# EAGLE board Mayfly_v1p0_revA3_public (EAGLE 9.6.2), part 1 of 2
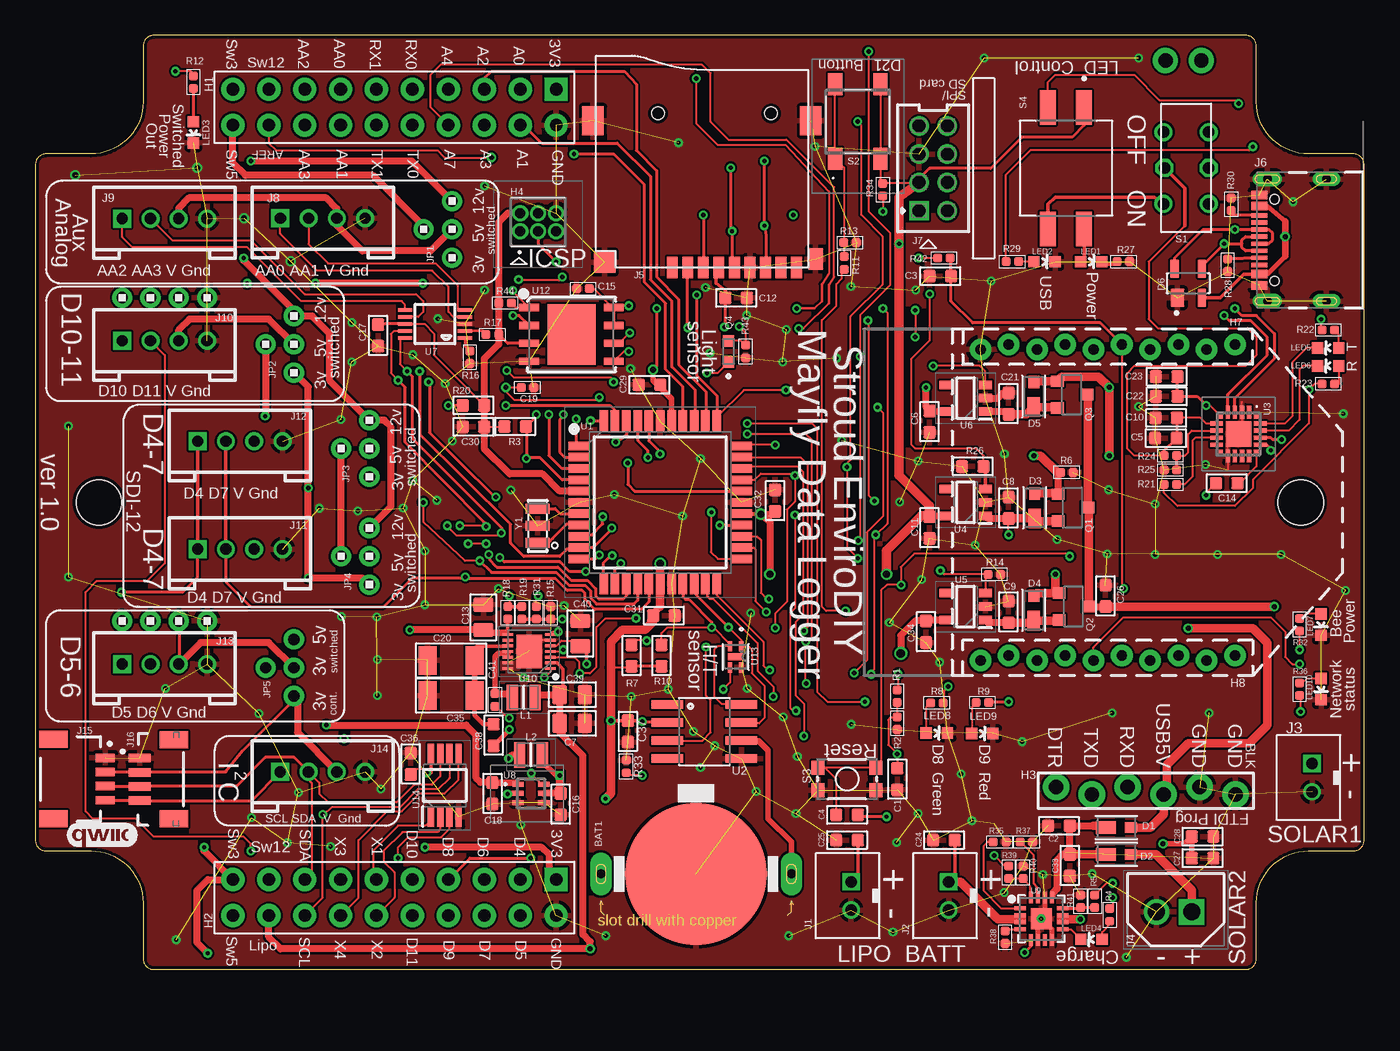
[diagram p1: board, top side]
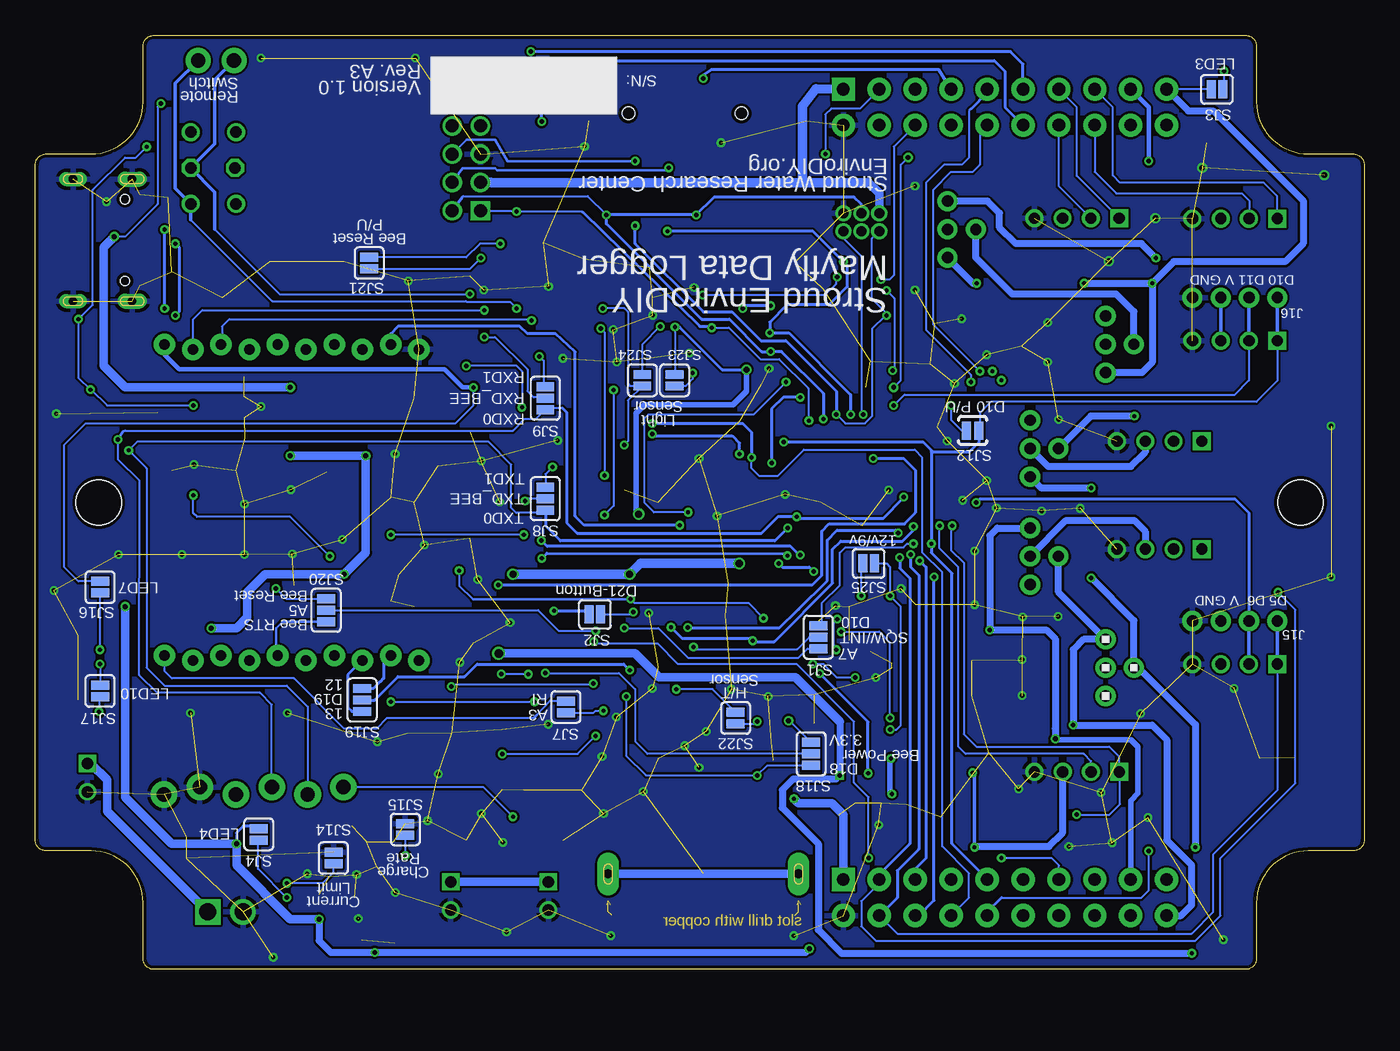
[diagram p2: board, bottom side, seen from below]

Size 93.98 x 66.04 mm. Coordinates in mm from the lower left corner, seen from the top.
Outline: 0,56.9 0,9.14 arc90 0.76,8.38 3.94,8.38 arc-90 7.62,4.7 7.62,0.76 arc90 8.38,0 85.6,0 arc90 86.36,0.76 86.36,4.7 arc-90 90.04,8.38 93.22,8.38 arc90 93.98,9.14 93.98,56.9 arc90 93.22,57.66 90.04,57.66 arc-90 86.36,61.34 86.36,65.28 arc90 85.6,66.04 8.38,66.04 arc90 7.62,65.28 7.62,61.34 arc-90 3.94,57.66 0.76,57.66 arc90 0,56.9
Copper layers (1*2*15*16): Top 0.035mm / dielectric 0.2mm / Route2 0.0175mm / dielectric 1.1mm / Route15 0.0175mm / dielectric 0.2mm / Bottom 0.035mm
Design rules "DEEGOU-DRU": minimum track width 6mil, minimum drill 12mil, track to track 6mil, track to pad 6mil, pad to pad 6mil, via to via 6mil, smd to smd 0mil, copper to edge 10mil, drill to drill 10mil, minimum pad ring 6mil, minimum via ring 6mil, stop-mask expansion 2mil, vias tented up to drill 25mil, thermal gap 10mil
Holes 3.2 mm at 89.5,33.02 4.5,33.02

## Footprints (pad centres in the part's own frame; a part is rotated, then mirrored left to right if it is on the bottom)
BAT2P-13.5-CR1220 = drill 0.635 pad 1.524 long: +1 6.731,0; +2 -6.731,0 | smd 10 x 10: - 0,0
C0603 = smd 0.889 x 0.889: 1 -0.762,0; 2 0.762,0
C0805 = smd 1.397 x 1.016: 1 0,0.889; 2 0,-0.889
C0402 = smd 0.635 x 0.635: 1 -0.445,0; 2 0.445,0
C0603' = smd 0.889 x 0.889: 1 0,0.762; 2 0,-0.762
C1206 = smd 1.27 x 2.032: 1 -1.651,0; 2 1.651,0
DIODE_MSP3V3 = smd 1.397 x 0.889: 1 -0.749,0 | smd 0.864 x 0.762: 2 1.016,0
SOT143 = smd 0.99 x 1.3: 1 -0.76,-1.025 | smd 0.59 x 1.3: 2 0.96,-1.025; 3 0.96,1.025; 4 -0.96,1.025
H2X10-2.54 = drill 0.889 pad 1.651 square: 1 -1.27,11.43 | drill 0.889 pad 1.651: 2 -1.27,8.89; 3 -1.27,6.35; 4 -1.27,3.81; 5 -1.27,1.27; 6 -1.27,-1.27; 7 -1.27,-3.81; 8 -1.27,-6.35; 9 -1.27,-8.89; 10 -1.27,-11.43; 11 1.27,-11.43; 12 1.27,-8.89; 13 1.27,-6.35; 14 1.27,-3.81; 15 1.27,-1.27; 16 1.27,1.27; 17 1.27,3.81; 18 1.27,6.35; 19 1.27,8.89; 20 1.27,11.43
1X06_FEMALE_LOCK.010 = drill 1.016 pad 1.88: 1 0,0.254; 2 2.54,-0.254; 3 5.08,0.254; 4 7.62,-0.254; 5 10.16,0.254; 6 12.7,-0.254
FTSH-103-XX-YYY = drill 0.71 pad 1.15: 1 0,0; 2 0,1.27; 3 1.27,0; 4 1.27,1.27; 5 2.54,0; 6 2.54,1.27
1X4 = drill 0.8 pad 1.422: 1 -3,0; 2 -1,0; 3 1,0; 4 3,0
XBEE-1_LOCK = drill 0.737 pad 1.524: 1 -11.178,20; 2 -10.822,18; 3 -11.178,16; 4 -10.822,14; 5 -11.178,12; 6 -10.822,10; 7 -11.178,8; 8 -10.822,6; 9 -11.178,4; 10 -10.822,2; 11 11.178,2; 12 10.822,4; 13 11.178,6; 14 10.822,8; 15 11.178,10; 16 10.822,12; 17 11.178,14; 18 10.822,16; 19 11.178,18; 20 10.822,20
PTH-JUMPER-2-NO_NO_SILK = drill 1.016 pad 1.778: 1 -1.27,0; 2 1.27,0
JST_EPH_B2B-PH-K-S = drill 0.813 square: 1 2,0 | drill 0.813: 2 0,0
SHDR2W70P0X250_1X2_670X500X765 = drill 1.2 pad 1.8 square: 1 0,0 | drill 1.2 pad 1.8: 2 2.5,0
9P-SMD-W-RING = smd 1.524 x 0.762: 1 -7.493,2.114; 2 -7.493,1.014; 3 -7.493,-0.086; 4 -7.493,-1.186; 5 -7.493,-2.286; 6 -7.493,-3.386; 7 -7.493,-4.486; 8 -7.493,-5.586; 9 -7.493,-6.686 | smd 1.524 x 1.016: G1 -6.893,-8.032 | smd 2.032 x 1.524: G2 2.88,-7.686; G3 2.88,7.714 | smd 1.524 x 1.524: G4 -7.101,6.895 | hole 0.889: 3.407,-4.886; 3.407,3.114
GCT_USB4105_REVA = smd 0.6 x 1.15: A1/B12 -3.2,4.755; A4/B9 -2.4,4.755; B1/A12 3.2,4.755; B4/A9 2.4,4.755 | smd 0.3 x 1.15: A5 -1.25,4.755; A6 -0.25,4.755; A7 0.25,4.755; A8 1.25,4.755; B5 1.75,4.755; B6 0.75,4.755; B7 -0.75,4.755; B8 -1.75,4.755 | drill 0.6 pad 1 long: G1 -4.32,0; G2 4.32,0 | drill 0.6 pad 1.05 long: G3 -4.32,4.18; G4 4.32,4.18 | hole 0.65: 2.89,3.68; -2.89,3.68
79107-08 = drill 0.914 square: 1 -3,1 | drill 0.914: 2 -3,-1; 3 -1,1; 4 -1,-1; 5 1,1; 6 1,-1; 7 3,1; 8 3,-1
HW4-2.0 = drill 0.8 pad 1.27 square: 1 -3,0 | drill 0.8 pad 1.27: 2 -1,0; 3 1,0; 4 3,0
JST04_1MM_RA = smd 0.6 x 1.35: 1 -1.5,0; 2 -0.5,0; 3 0.5,0; 4 1.5,0 | smd 1.2 x 2: NC1 2.8,-3.675; NC2 -2.8,-3.675
JST04_1MM_VERT = smd 0.6 x 1.55: 1 -1.478,0.775; 2 -0.478,0.775; 3 0.522,0.775; 4 1.522,0.775 | smd 1.2 x 2: NC1 -2.778,3.2; NC2 2.822,3.2
1X3 = drill 0.8 pad 1.422: 1 -2,0; 2 0,0; 3 2,0; 4 0,-2
1285ASH1R0MP2 = smd 0.8 x 1.8: 1 -0.8,0; 2 0.8,0
LED-0603 = smd 0.8 x 0.8: A 0,-0.75; C 0,0.75
SOT23-S-PADS = smd 0.8 x 0.9: 1 -0.95,-1; 2 0.95,-1; 3 0,1.1
XDCR_ALS-PT19-315C/L177/TR8 = smd 0.8 x 0.8: 1 -0.75,0; 2 0.75,0
R0402 = smd 0.635 x 0.635: 1 -0.445,0; 2 0.445,0
R0603 = smd 0.889 x 0.889: 1 -0.762,0; 2 0.762,0
6P-2CH-2.54-9.1X3.5X3.2+2H = drill 0.813 pad 1.27: CH1A -2.54,-1.6; CH1B 2.54,-1.6; CH2A -2.54,1.6; CH2B 2.54,1.6 | drill 0.813 pad 1.27 octagon: COM1 0,-1.6; COM2 0,1.524
PTS647SK38SMTR2LFS = smd 1.55 x 1: 1 -2.625,1.6; 2 2.625,1.6; 3 -2.625,-1.6; 4 2.625,-1.6
TACTILE_SWITCH_SMD_4.6X2.8MM = smd 0.9 x 1: 1 -2.05,-0.8; 2 2.05,-0.8; 3 2.05,0.8; 4 -2.05,0.8
SW_219-2MSTR = smd 2.44 x 1.13: 1A -4.3,1.27; 1B 4.3,1.27; 2A -4.3,-1.27; 2B 4.3,-1.27
SMT-JUMPER_3_1-NC_PASTE_SILK = smd 0.635 x 1.27: 1 -0.813,0; 2 0,0; 3 0.813,0
SMT-JUMPER_2_NC_PASTE_SILK = smd 0.635 x 1.27: 1 -0.406,0; 2 0.406,0
SMT-JUMPER_2_NO_SILK = smd 0.635 x 1.27: 1 -0.406,0; 2 0.406,0
SJ_2S-NO = smd 0.635 x 1.27: 1 -0.45,0; 2 0.45,0
QFP80P1200X1200X120-44N = smd 1.5 x 0.6: 1 -5.75,4; 2 -5.75,3.2; 3 -5.75,2.4; 4 -5.75,1.6; 5 -5.75,0.8; 6 -5.75,0; 7 -5.75,-0.8; 8 -5.75,-1.6; 9 -5.75,-2.4; 10 -5.75,-3.2; 11 -5.75,-4; 23 5.75,-4; 24 5.75,-3.2; 25 5.75,-2.4; 26 5.75,-1.6; 27 5.75,-0.8; 28 5.75,0; 29 5.75,0.8; 30 5.75,1.6; 31 5.75,2.4; 32 5.75,3.2; 33 5.75,4 | smd 0.6 x 1.5: 12 -4,-5.75; 13 -3.2,-5.75; 14 -2.4,-5.75; 15 -1.6,-5.75; 16 -0.8,-5.75; 17 0,-5.75; 18 0.8,-5.75; 19 1.6,-5.75; 20 2.4,-5.75; 21 3.2,-5.75; 22 4,-5.75; 34 4,5.75; 35 3.2,5.75; 36 2.4,5.75; 37 1.6,5.75; 38 0.8,5.75; 39 0,5.75; 40 -0.8,5.75; 41 -1.6,5.75; 42 -2.4,5.75; 43 -3.2,5.75; 44 -4,5.75
SO8 = smd 0.61 x 2.21: 1 -1.845,-2.946; 2 -0.575,-2.946; 3 0.695,-2.946; 4 1.965,-2.946; 5 1.965,2.286; 6 0.695,2.286; 7 -0.575,2.286; 8 -1.845,2.286
CP2102NA02GQFN20 = smd 0.3 x 0.3: 1 -1.25,1.25; 6 -1.25,-1.25; 11 1.25,-1.25; 16 1.25,1.25 | smd 0.9 x 0.3: 2 -1.55,0.75; 3 -1.55,0.25; 4 -1.55,-0.25; 5 -1.55,-0.75; 12 1.55,-0.75; 13 1.55,-0.25; 14 1.55,0.25; 15 1.55,0.75 | smd 0.3 x 0.9: 7 -0.75,-1.55; 8 -0.25,-1.55; 9 0.25,-1.55; 10 0.75,-1.55; 17 0.75,1.55; 18 0.25,1.55; 19 -0.25,1.55; 20 -0.75,1.55 | smd 1.8 x 1.8: 21 0,0
SOT95P280X130-5N = smd 0.9 x 0.6: 1 -1.4,0.95; 2 -1.4,0; 3 -1.4,-0.95; 4 1.4,-0.95; 5 1.4,0.95
MSOP10 = smd 0.25 x 1: 1 -1,-2.113; 2 -0.5,-2.113; 3 0,-2.113; 4 0.5,-2.113; 5 1,-2.113; 6 1,2.113; 7 0.5,2.113; 8 0,2.113; 9 -0.5,2.113; 10 -1,2.113
MAX17225ELTT = smd 0.35 x 0.8: 1 -0.65,-0.915; 2 0,-0.915; 3 0.65,-0.915; 4 0.65,0.915; 5 0,0.915; 6 -0.65,0.915
ADAFRUIT_POWER_QFN16_3MM = smd 0.8 x 0.28: 1 -1.5,0.75; 2 -1.5,0.25; 3 -1.5,-0.25; 4 -1.5,-0.75; 9 1.5,-0.75; 10 1.5,-0.25; 11 1.5,0.25; 12 1.5,0.75 | smd 0.28 x 0.8: 5 -0.75,-1.5; 6 -0.25,-1.5; 7 0.25,-1.5; 8 0.75,-1.5; 13 0.75,1.5; 14 0.25,1.5; 15 -0.25,1.5; 16 -0.75,1.5 | smd 1.5 x 1.5: THERMAL 0,0
SON40P300X300X80-15N = smd 0.75 x 0.2: 1 -1.5,1.2; 2 -1.5,0.8; 3 -1.5,0.4; 4 -1.5,0; 5 -1.5,-0.4; 6 -1.5,-0.8; 7 -1.5,-1.2; 8 1.5,-1.2; 9 1.5,-0.8; 10 1.5,-0.4; 11 1.5,0; 12 1.5,0.4; 13 1.5,0.8; 14 1.5,1.2 | smd 1.8 x 2.4: 15 0,0
WSON8-6X5MM = smd 0.5 x 1.4: 1 -1.905,-3; 2 -0.635,-3; 3 0.635,-3; 4 1.905,-3; 5 1.905,3; 6 0.635,3; 7 -0.635,3; 8 -1.905,3 | smd 4.3 x 3.4: EP 0,0
SHT4X_SEN = smd 0.711 x 0.305: 1 -0.749,0.4; 2 -0.749,-0.4; 3 0.749,-0.4; 4 0.749,0.4 | smd 0.508 x 1.092: 5 0,0
SOP65P490X110-8N = smd 1.425 x 0.45: 1 -2.212,0.975; 2 -2.212,0.325; 3 -2.212,-0.325; 4 -2.212,-0.975; 5 2.212,-0.975; 6 2.212,-0.325; 7 2.212,0.325; 8 2.212,0.975
X3-SMD-3.6X1.3X0.8MM = smd 0.7 x 1.7: 1 -1.2,0; 2 0,0; 3 1.2,0

## Placement (x,y rotation side)
BAT1  CR1220  [BAT2P-13.5-CR1220]  46.73,6.75 0 top
C1  100nF  [C0603]  60.96,13.46 90 top
C2  10uF  [C0603]  72.39,10.16 0 top
C3  0.01uF  [C0603]  64.01,49.02 0 top
C4  100nF  [C0603]  57.4,10.92 180 top
C5  100nF  [C0603]  79.95,37.56 0 top
C6  4.7uF  [C0603]  63.25,38.73 90 top
C7  22uf  [C0805]  37.97,17.4 90 top
C8  10uF  [C0603]  68.83,32.64 270 top
C9  10uF  [C0603]  68.83,25.27 270 top
C10  4.7uF  [C0603]  79.98,39 0 top
C11  4.7uF  [C0603]  63.25,31.24 90 top
C12  100nF  [C0603]  49.56,47.49 180 top
C13  10uf  [C0805]  31.69,24.89 180 top
C14  100nF  [C0603]  84.25,34.38 0 top
C15  100nF  [C0402]  38.73,48.13 0 top
C16  10uf  [C0603']  37.15,11.68 180 top
C17  10uF  [C0603]  24.23,44.83 270 top
C18  10uf  [C0603']  32.32,12.45 0 top
C19  100nF  [C0402]  34.8,41.15 180 top
C20  22uF  [C1206]  29.4,21.84 0 top
C21  10uF  [C0603]  68.83,40.01 270 top
C22  100nF  [C0603]  80.01,40.51 0 top
C23  4.7uF  [C0603]  80.01,41.91 0 top
C24  10uF  [C0603]  64.26,9.14 0 top
C25  10uF  [C0603]  57.4,9.14 0 top
C26  10uF  [C0603]  75.69,26.42 270 top
C27  10uF  [C0603]  82.55,7.87 180 top
C28  10uF  [C0603]  82.55,9.4 180 top
C29  100nF  [C0603]  43.43,41.34 0 top
C30  100nF  [C0603]  30.99,38.35 0 top
C31  100nF  [C0603]  44.45,25.02 180 top
C32  100nF  [C0603]  52.32,33.15 270 top
C33  10uF  [C0603]  73.15,7.37 90 top
C34  4.7uF  [C0603]  62.99,23.88 90 top
C35  22uF  [C1206]  29.4,19.37 0 top
C36  100nF  [C0603]  26.54,14.54 270 top
C37  100nF  [C0603]  41.91,16.83 90 top
C38  4.7nf  [C0603']  32.41,16.57 180 top
C39  22uf  [C0805]  37.97,19.43 90 top
C40  2.2uf  [C0805]  38.54,23.75 0 top
C41  0.1uF  [C0402]  32.51,19.05 270 top
D1  MSS2P2-M3/89A  [DIODE_MSP3V3]  76.45,10.03 0 top
D2  MSS2P2-M3/89A  [DIODE_MSP3V3]  76.45,8.13 0 top
D3  MSS2P2-M3/89A  [DIODE_MSP3V3]  70.68,32.64 90 top
D4  MSS2P2-M3/89A  [DIODE_MSP3V3]  70.61,25.4 90 top
D5  MSS2P2-M3/89A  [DIODE_MSP3V3]  70.61,40.51 90 top
D6  SP0503BAHTG  [SOT143]  81.53,48.51 0 top
H1  2X10P-2.54  [H2X10-2.54]  25.4,60.96 270 top
H2  2X10P-2.54  [H2X10-2.54]  25.4,5.08 270 top
H3  6P-2.54  [1X06_FEMALE_LOCK.010]  72.18,12.63 0 top
H4  FTSH-103-01-F-D  [FTSH-103-XX-YYY]  34.29,52.2 0 top
H5  1X4  [1X4]  9.14,24.64 0 top
H6  1X4  [1X4]  9.14,47.5 0 top
H7-H8  XBEE-1XBEE-1_LOCK  [XBEE-1_LOCK]  64.84,33.02 270 top
H10  JUMPER-PTH-2-NO  [PTH-JUMPER-2-NO_NO_SILK]  81.2,64.26 0 top
J1  JST_EPH_2PIN  [JST_EPH_B2B-PH-K-S]  57.7,4.2 90 top
J2  JST_EPH_2PIN  [JST_EPH_B2B-PH-K-S]  64.6,4.2 90 top
J3  JST_EPH_2PIN  [JST_EPH_B2B-PH-K-S]  90.3,12.56 90 top
J4  1778557  [SHDR2W70P0X250_1X2_670X500X765]  81.79,4.06 180 top
J5  MICRO-SDCARD-CONNECTOR-3300060P1  [9P-SMD-W-RING]  47.15,57.12 90 top
J6  USB4105_REVA  [GCT_USB4105_REVA]  91.31,51.56 90 top
J7  79107-08_S  [79107-08]  63.5,56.64 90 top
J8  Grove AA0-1  [HW4-2.0]  20.32,53.11 0 top
J9  Grove AA2-3  [HW4-2.0]  9.14,53.09 0 top
J10  Grove D10-11  [HW4-2.0]  9.14,44.45 0 top
J11  Grove D4-7  [HW4-2.0]  14.48,29.72 0 top
J12  Grove D4-7  [HW4-2.0]  14.48,37.34 0 top
J13  Grove D5-6  [HW4-2.0]  9.14,21.59 0 top
J14  Grove I2C  [HW4-2.0]  20.32,13.97 0 top
J15  QWIIC_RIGHT_ANGLE  [JST04_1MM_RA]  4.95,13.46 270 top
J16  Vertical Qwiic Connector  [JST04_1MM_VERT]  6.6,13.46 270 top
JP1  1X3X11  [1X3]  29.46,52.32 270 top
JP2  1X3X11  [1X3]  18.29,44.2 270 top
JP3  1X3X11  [1X3]  23.62,36.83 270 top
JP4  1X3X11  [1X3]  23.62,29.21 270 top
JP5  1X3X11  [1X3]  18.29,21.34 90 bottom
L1  2.2uH  [1285ASH1R0MP2]  34.54,19.24 180 top
L2  2.2uH  [1285ASH1R0MP2]  35.05,15.18 180 top
LED1  Green  [LED-0603]  74.68,50.04 270 top
LED2  Orange  [LED-0603]  71.37,50.04 270 top
LED3  Red  [LED-0603]  11.18,59.18 180 top
LED4  Yellow  [LED-0603]  74.7,2.13 90 top
LED5  Red  [LED-0603]  91.44,43.94 90 top
LED6  Green  [LED-0603]  91.44,42.67 90 top
LED7  White  [LED-0603]  90.93,24.38 180 top
LED8  Green  [LED-0603]  63.75,16.72 270 top
LED9  Red  [LED-0603]  66.98,16.68 270 top
LED10  Blue  [LED-0603]  90.93,19.81 180 top
LOGO4  QWIIC_LOGO_5MM  [QWIIC_5MM]  4.7,9.53 0 top
Q1  FDN340P  [SOT23-S-PADS]  73.34,32.65 270 top
Q2  FDN340P  [SOT23-S-PADS]  73.41,25.65 270 top
Q3  FDN340P  [SOT23-S-PADS]  73.28,40.64 270 top
Q4  ALS-PT19-315C/L177/TR8  [XDCR_ALS-PT19-315C/L177/TR8]  49.02,43.69 90 top
R1  10M  [R0402]  60.96,19.3 90 top
R2  2.7M  [R0402]  60.96,17.4 90 top
R3  100k  [R0603]  33.93,38.39 180 top
R4  1k  [R0402]  75.99,3.85 270 top
R5  3.3k  [R0402]  74.93,4.83 270 top
R6  100k  [R0402]  72.94,35.15 180 top
R7  2k  [R0603]  42.16,22.18 90 top
R8  1.2k  [R0402]  63.75,18.85 180 top
R9  1k  [R0402]  66.98,18.87 180 top
R10  2k  [R0603]  44.28,22.18 270 top
R11  100  [R0402]  57.2,49.95 270 top
R12  1k  [R0402]  11.18,62.74 90 top
R13  100k  [R0402]  57.62,51.38 180 top
R14  100k  [R0402]  67.82,27.94 180 top
R15  10k  [R0402]  36.45,25.21 270 top
R16  10K  [R0402]  30.72,43.28 270 top
R17  10K  [R0402]  32.32,44.9 180 top
R18  1k  [R0402]  33.4,25.21 90 top
R19  84.5k  [R0402]  34.42,25.21 270 top
R20  1M  [R0603]  30.99,39.88 0 top
R21  1k  [R0402]  80.26,34.29 180 top
R22  1k  [R0402]  91.44,45.21 0 top
R23  1.2k  [R0402]  91.44,41.4 0 top
R24  22.1k  [R0402]  80.26,36.32 180 top
R25  47.5k  [R0402]  80.26,35.31 0 top
R26  100k  [R0603]  66.29,35.56 0 top
R27  1.2k  [R0402]  76.96,50.04 180 top
R28  5.1k  [R0402]  84.33,49.78 270 top
R29  1k  [R0402]  69.09,50.04 0 top
R30  5.1k  [R0402]  84.58,54.1 90 top
R31  220k  [R0402]  35.43,25.21 270 top
R32  3.3k  [R0402]  89.41,24.38 270 top
R33  100k  [R0402]  41.78,14.35 270 top
R34  1M  [R0402]  59.94,55.12 270 top
R35  10k  [R0402]  68.2,9.02 180 top
R36  1k  [R0402]  89.41,19.81 90 top
R37  10k  [R0402]  70.1,9.02 180 top
R38  10k  [R0402]  68.58,2.29 90 top
R39  1.8K  [R0402]  68.83,6.86 270 top
R40  1.8K  [R0402]  69.85,6.86 270 top
R41  3.3k  [R0402]  73.91,4.83 270 top
R42  100k  [R0402]  64.26,50.29 180 top
R43  10k  [R0402]  50.23,43.69 270 top
R44  1M  [R0402]  33.21,47.12 0 top
S1  SWITCH-2CH-6P-3010010P1  [6P-2CH-2.54-9.1X3.5X3.2+2H]  81.39,56.67 90 top
S2  PTS647SK38SMTR2LFS  [PTS647SK38SMTR2LFS]  58.17,59.94 90 top
S3  [TACTILE_SWITCH_SMD_4.6X2.8MM]  57.4,13.46 0 top
S4  219-2MSTR  [SW_219-2MSTR]  72.9,56.64 270 top
SJ1  JUMPER-SMT_3_1-NC_PASTE_SILK  [SMT-JUMPER_3_1-NC_PASTE_SILK]  38.61,23.5 270 bottom
SJ2  JUMPER-SMT_2_NC_PASTE_SILK  [SMT-JUMPER_2_NC_PASTE_SILK]  54.4,25.1 0 bottom
SJ3  JUMPER-SMT_2_NC_PASTE_SILK  [SMT-JUMPER_2_NC_PASTE_SILK]  10.41,62.23 0 bottom
SJ4  JUMPER-SMT_2_NC_PASTE_SILK  [SMT-JUMPER_2_NC_PASTE_SILK]  78.18,9.56 270 bottom
SJ7  JUMPER-SMT_2_NO_SILK  [SMT-JUMPER_2_NO_SILK]  56.46,18.56 270 bottom
SJ8  JUMPER-SMT_3_1-NC_PASTE_SILK  [SMT-JUMPER_3_1-NC_PASTE_SILK]  57.91,33.27 90 bottom
SJ9  JUMPER-SMT_3_1-NC_PASTE_SILK  [SMT-JUMPER_3_1-NC_PASTE_SILK]  57.91,40.39 90 bottom
SJ12  SOLDERJUMPERNO  [SJ_2S-NO]  27.69,38.1 180 bottom
SJ14  JUMPER-SMT_2_NC_PASTE_SILK  [SMT-JUMPER_2_NC_PASTE_SILK]  72.9,7.87 90 bottom
SJ15  JUMPER-SMT_2_NO_SILK  [SMT-JUMPER_2_NO_SILK]  67.82,9.91 270 bottom
SJ16  JUMPER-SMT_2_NO_SILK  [SMT-JUMPER_2_NO_SILK]  89.41,27.03 270 bottom
SJ17  JUMPER-SMT_2_NO_SILK  [SMT-JUMPER_2_NO_SILK]  89.41,19.68 90 bottom
SJ18  JUMPER-SMT_3_1-NC_PASTE_SILK  [SMT-JUMPER_3_1-NC_PASTE_SILK]  39.12,15.24 270 bottom
SJ19  JUMPER-SMT_3_1-NC_PASTE_SILK  [SMT-JUMPER_3_1-NC_PASTE_SILK]  70.87,19.05 90 bottom
SJ20  JUMPER-SMT_3_1-NC_PASTE_SILK  [SMT-JUMPER_3_1-NC_PASTE_SILK]  73.41,25.4 90 bottom
SJ21  JUMPER-SMT_2_NC_PASTE_SILK  [SMT-JUMPER_2_NC_PASTE_SILK]  70.36,49.94 90 bottom
SJ22  JUMPER-SMT_2_NC_PASTE_SILK  [SMT-JUMPER_2_NC_PASTE_SILK]  44.45,17.78 90 bottom
SJ23  JUMPER-SMT_2_NC_PASTE_SILK  [SMT-JUMPER_2_NC_PASTE_SILK]  48.77,41.66 270 bottom
SJ24  JUMPER-SMT_2_NC_PASTE_SILK  [SMT-JUMPER_2_NC_PASTE_SILK]  51.05,41.66 270 bottom
SJ25  JUMPER-SMT_2_NO_SILK  [SMT-JUMPER_2_NO_SILK]  35.05,28.7 0 bottom
U1  ATMEGA1284P-AU-TQFP  [QFP80P1200X1200X120-44N]  44.2,33.02 0 top
U2  DS3231M_SOIC8  [SO8]  47.65,16.88 270 top
U3  CP2102N-A02-GQFN20  [CP2102NA02GQFN20]  85.09,37.85 270 top
U4  XC6220B331MR-G  [SOT95P280X130-5N]  65.79,33.02 180 top
U5  XC6220B331MR-G  [SOT95P280X130-5N]  65.79,25.65 180 top
U6  XC6220B331MR-G  [SOT95P280X130-5N]  65.79,40.39 180 top
U7  ADS1115IDGST  [MSOP10]  28.26,45.63 90 top
U8  MAX17225ELT+T  [MAX17225ELTT]  35.05,12.45 270 top
U9  ADAFRUIT_POWER_BQ24074  [ADAFRUIT_POWER_QFN16_3MM]  71.14,3.58 0 top
U10  MAX17250ATD+  [SON40P300X300X80-15N]  34.92,22.48 180 top
U12  GD25Q64EWIGR  [WSON8-6X5MM]  37.91,44.89 270 top
U13  SHT40-AD1B-R2  [SHT4X_SEN]  49.53,22.1 270 top
U14  PCA9536DGKR  [SOP65P490X110-8N]  28.96,13.02 90 top
Y1  8MHZ  [X3-SMD-3.6X1.3X0.8MM]  35.53,31.38 90 top